# Altium schematic sheet CH340C.SchDoc
size A4; SheetNumber: 6; SheetTotal: 9
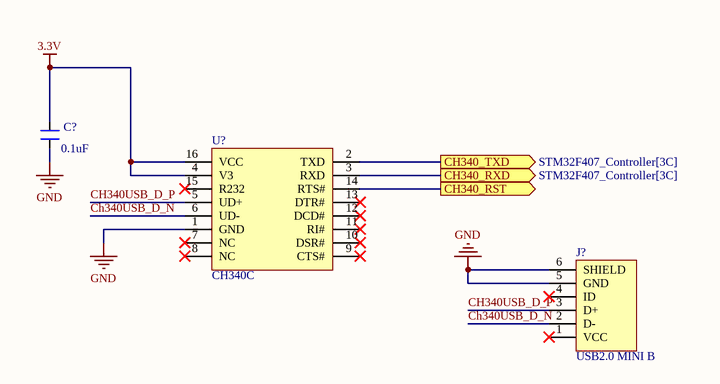
[diagram p0: CH340C.SchDoc]

## Parts
C?  0.1uF  [CAP_0805]
J?  USB2.0 MINI B  [CON_690-005-299-043]
U?  CH340C  [SOIC16_50_284_25X90_SMT]

## Ports
CH340_RST (out), CH340_RXD (out, see STM32F407_Controller[3C]), CH340_TXD (out, see STM32F407_Controller[3C])

## Nets
3.3V: C?.2 U?.4(V3) U?.16(VCC)
GND: C?.1 J?.5(GND) J?.6(SHIELD) U?.1(GND)
CH340_RST: U?.14(RTS#) ; port CH340_RST
CH340_RXD: U?.3(RXD) ; port CH340_RXD
CH340_TXD: U?.2(TXD) ; port CH340_TXD
Ch340USB_D_N: J?.2(D-) U?.6(UD-)
CH340USB_D_P: J?.3(D+) U?.5(UD+)

Not connected (* = marked no-connect by the designer): J? 1(VCC)* 4(ID)*; U? 7(NC)* 8(NC)* 9(CTS#)* 10(DSR#)* 11(RI#)* 12(DCD#)* 13(DTR#)* 15(R232)*

## Library data of the parts
C? = CAP_0.1uF-50V-10%-0805: 0.1µF ±10% 50V Ceramic Capacitor X7R 0805 (2012 Metric); Manufacturer: Samsung; Manufacturer Part Number: CL21B104KBCNNNC; Alternate Part Number-1: NA; Case/Package: 0805; Supplier-1: SIRICOM; Supplier Part Number-1: 0805B104K500CT
J? = CON_USB2.0-MINIB-SMD: USB - mini B USB 2.0 Receptacle Connector 5 Position Surface Mount, Right Angle; Manufacturer: EDAC; Manufacturer Part Number: 690-005-299-043; Alternate Part Number-1: NA; Case/Package: USB-MINI-B; Supplier-1: LCSC; Supplier Part Number-1: C105424
U? = IC_CH340C: USB Bridge, USB to UART USB 2.0 UART Interface; Manufacturer: Olimex; Alternate Part Number-1: NA; Manufacturer Part Number: CH340C; Case/Package: SOIC16; Supplier-1: LCSC; Supplier Part Number-1: C84681